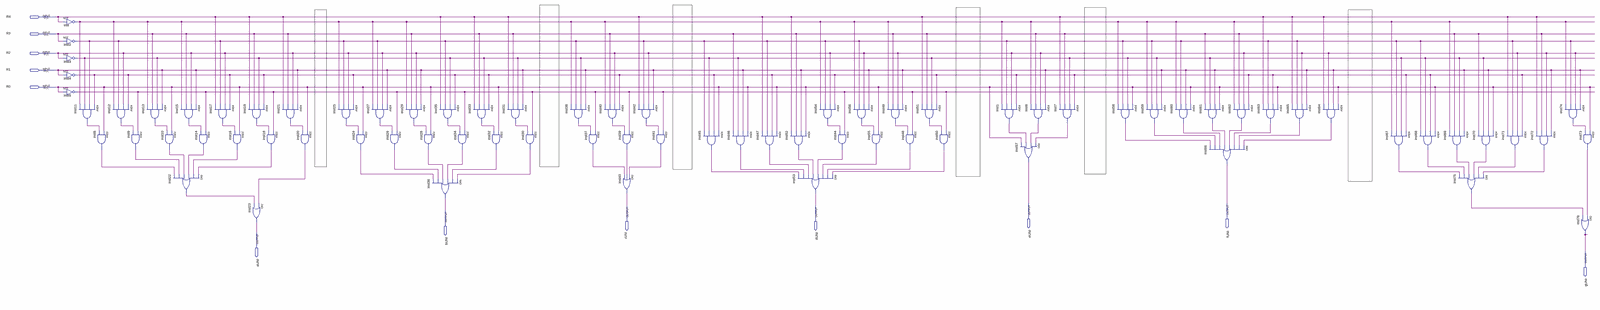
[diagram p0: schematic sheet, whole]
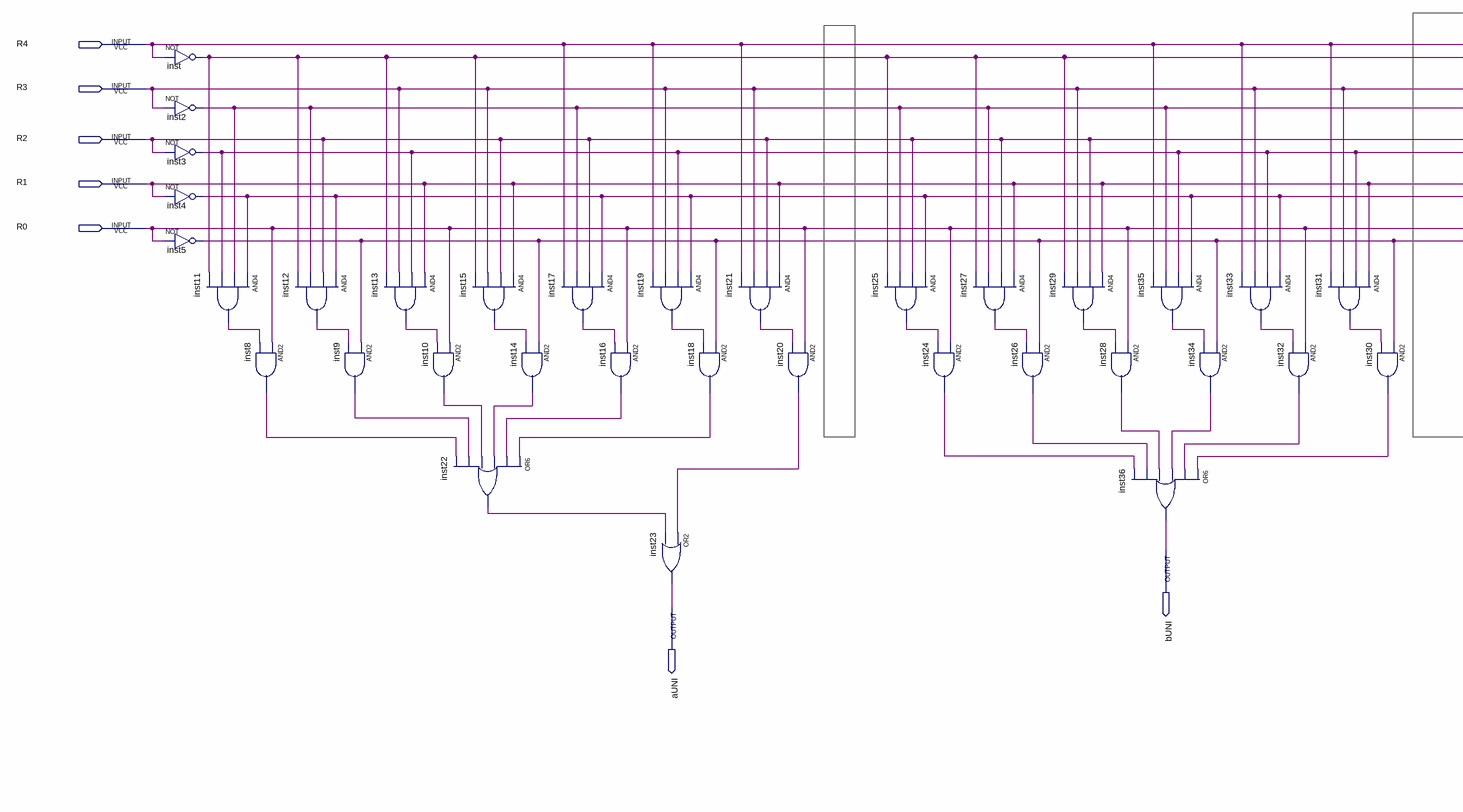
[diagram p1: schematic sheet, left part]
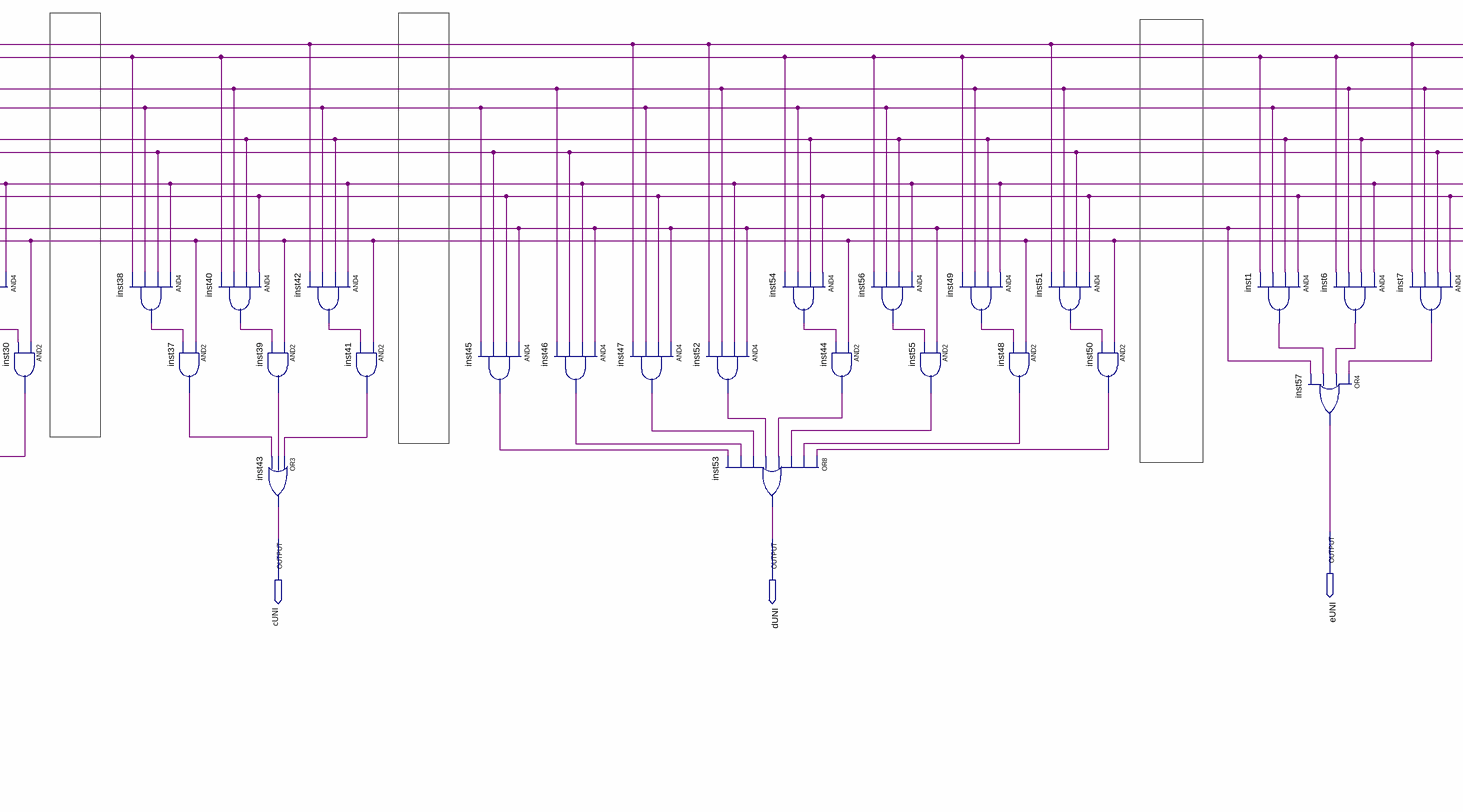
[diagram p2: schematic sheet, centre part]
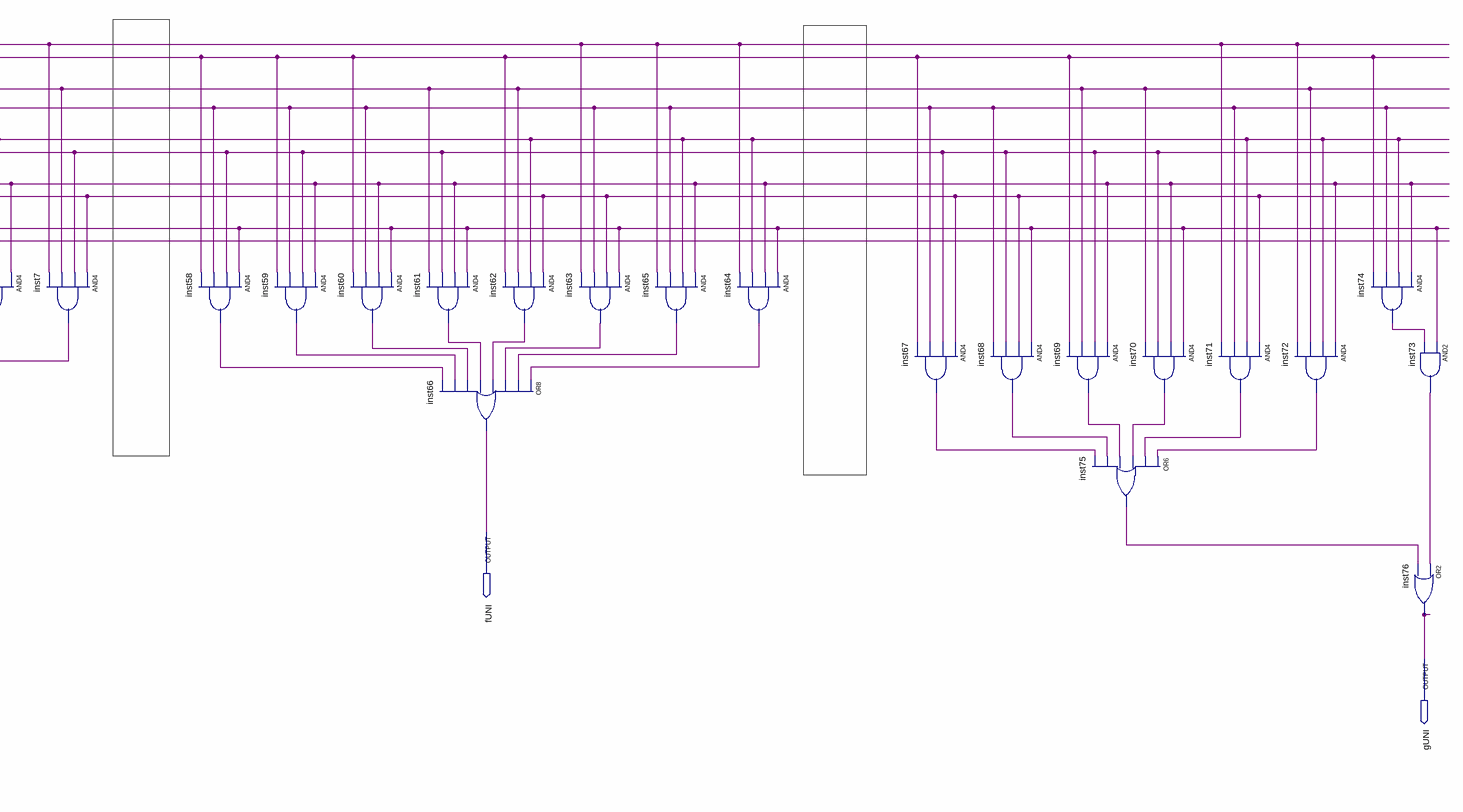
[diagram p3: schematic sheet, right part]
// Quartus schematic decod7segUnidade.bdf as structural Verilog: 77 symbols, 12 pins
module decod7segUnidade (
  input  R4,
  input  R3,
  input  R2,
  input  R1,
  input  R0,
  output eUNI,
  output fUNI,
  output cUNI,
  output dUNI,
  output bUNI,
  output aUNI,
  output gUNI
);

  wire inst1_out, inst2_out, inst3_out, inst4_out, inst5_out, inst6_out, inst7_out, inst8_out, inst9_out,
       inst10_out, inst11_out, inst12_out, inst13_out, inst14_out, inst15_out, inst16_out, inst17_out,
       inst18_out, inst19_out, inst20_out, inst21_out, inst22_out, inst24_out, inst25_out, inst26_out,
       inst27_out, inst28_out, inst29_out, inst30_out, inst31_out, inst32_out, inst33_out, inst34_out,
       inst35_out, inst37_out, inst38_out, inst39_out, inst40_out, inst41_out, inst42_out, inst44_out,
       inst45_out, inst46_out, inst47_out, inst48_out, inst49_out, inst50_out, inst51_out, inst52_out,
       inst54_out, inst55_out, inst56_out, inst58_out, inst59_out, inst60_out, inst61_out, inst62_out,
       inst63_out, inst64_out, inst65_out, inst67_out, inst68_out, inst69_out, inst70_out, inst71_out,
       inst72_out, inst73_out, inst74_out, inst75_out, inst_out;

  not inst (inst_out, R4);
  not inst2 (inst2_out, R3);
  not inst3 (inst3_out, R2);
  not inst4 (inst4_out, R1);
  not inst5 (inst5_out, R0);
  and inst11 (inst11_out, inst4_out, inst2_out, inst3_out, inst_out);
  and inst12 (inst12_out, inst4_out, R2, inst2_out, inst_out);
  and inst8 (inst8_out, R0, inst11_out);
  and inst9 (inst9_out, inst5_out, inst12_out);
  and inst13 (inst13_out, R1, inst3_out, R3, inst_out);
  and inst10 (inst10_out, R0, inst13_out);
  and inst15 (inst15_out, R1, R2, R3, inst_out);
  or inst22 (inst22_out, inst18_out, inst16_out, inst14_out, inst10_out, inst9_out, inst8_out);
  and inst14 (inst14_out, inst5_out, inst15_out);
  and inst17 (inst17_out, inst4_out, R2, inst2_out, R4);
  and inst19 (inst19_out, inst4_out, inst3_out, R3, R4);
  and inst16 (inst16_out, R0, inst17_out);
  and inst18 (inst18_out, inst5_out, inst19_out);
  or inst23 (aUNI, inst20_out, inst22_out);
  and inst21 (inst21_out, R1, R2, R3, R4);
  and inst20 (inst20_out, R0, inst21_out);
  and inst25 (inst25_out, inst4_out, R2, inst2_out, inst_out);
  and inst24 (inst24_out, R0, inst25_out);
  and inst27 (inst27_out, R1, R2, inst2_out, inst_out);
  and inst26 (inst26_out, inst5_out, inst27_out);
  and inst29 (inst29_out, R1, R2, R3, inst_out);
  and inst35 (inst35_out, inst4_out, inst3_out, inst2_out, R4);
  and inst28 (inst28_out, R0, inst29_out);
  or inst36 (bUNI, inst30_out, inst32_out, inst34_out, inst28_out, inst26_out, inst24_out);
  and inst34 (inst34_out, inst5_out, inst35_out);
  and inst33 (inst33_out, inst4_out, inst3_out, R3, R4);
  and inst32 (inst32_out, R0, inst33_out);
  and inst31 (inst31_out, R1, inst3_out, R3, R4);
  and inst30 (inst30_out, inst5_out, inst31_out);
  and inst38 (inst38_out, R1, inst3_out, inst2_out, inst_out);
  and inst37 (inst37_out, inst5_out, inst38_out);
  and inst40 (inst40_out, inst4_out, R2, R3, inst_out);
  and inst39 (inst39_out, inst5_out, inst40_out);
  or inst43 (cUNI, inst41_out, inst39_out, inst37_out);
  and inst42 (inst42_out, R1, R2, inst2_out, R4);
  and inst41 (inst41_out, inst5_out, inst42_out);
  and inst45 (inst45_out, R0, inst4_out, inst3_out, inst2_out);
  and inst46 (inst46_out, R0, R1, inst3_out, R3);
  and inst47 (inst47_out, R0, inst4_out, inst2_out, R4);
  and inst52 (inst52_out, R0, R1, R3, R4);
  or inst53 (dUNI, inst50_out, inst48_out, inst55_out, inst44_out, inst52_out, inst47_out, inst46_out, inst45_out);
  and inst54 (inst54_out, inst4_out, R2, inst2_out, inst_out);
  and inst44 (inst44_out, inst5_out, inst54_out);
  and inst56 (inst56_out, R1, R2, inst2_out, inst_out);
  and inst49 (inst49_out, R1, R2, R3, inst_out);
  and inst55 (inst55_out, R0, inst56_out);
  and inst48 (inst48_out, inst5_out, inst49_out);
  and inst51 (inst51_out, inst4_out, inst3_out, R3, R4);
  and inst50 (inst50_out, inst5_out, inst51_out);
  and inst1 (inst1_out, inst4_out, R2, inst2_out, inst_out);
  or inst57 (eUNI, inst7_out, inst6_out, inst1_out, R0);
  and inst6 (inst6_out, R1, R2, R3, inst_out);
  and inst7 (inst7_out, inst4_out, inst3_out, R3, R4);
  and inst58 (inst58_out, R0, inst3_out, inst2_out, inst_out);
  and inst59 (inst59_out, R1, inst3_out, inst2_out, inst_out);
  and inst60 (inst60_out, R0, R1, inst2_out, inst_out);
  and inst61 (inst61_out, R0, R1, inst3_out, R3);
  or inst66 (fUNI, inst64_out, inst65_out, inst63_out, inst62_out, inst61_out, inst60_out, inst59_out, inst58_out);
  and inst62 (inst62_out, inst4_out, R2, R3, inst_out);
  and inst63 (inst63_out, R0, inst4_out, inst2_out, R4);
  and inst65 (inst65_out, R1, R2, inst2_out, R4);
  and inst64 (inst64_out, R0, R1, R2, R4);
  and inst67 (inst67_out, inst4_out, inst3_out, inst2_out, inst_out);
  and inst68 (inst68_out, R0, inst4_out, inst3_out, inst2_out);
  and inst69 (inst69_out, R1, inst3_out, R3, inst_out);
  or inst75 (inst75_out, inst72_out, inst71_out, inst70_out, inst69_out, inst68_out, inst67_out);
  and inst70 (inst70_out, R0, R1, inst3_out, R3);
  and inst71 (inst71_out, inst4_out, R2, inst2_out, R4);
  and inst72 (inst72_out, R1, R2, R3, R4);
  and inst74 (inst74_out, R1, R2, inst2_out, inst_out);
  and inst73 (inst73_out, R0, inst74_out);
  or inst76 (gUNI, inst73_out, inst75_out);
endmodule
